# Altium schematic sheet DroneMCU.SchDoc
size A4; SheetNumber: 3; SheetTotal: 3
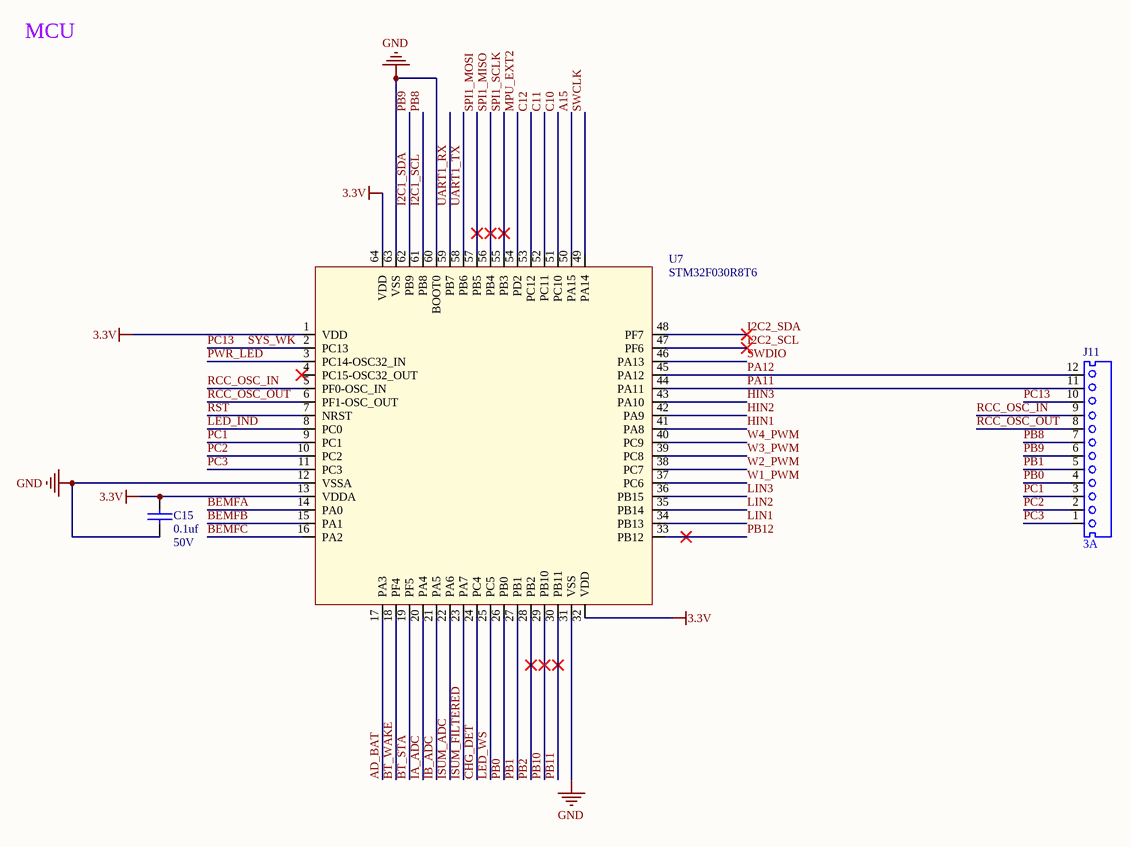
[diagram p0: DroneMCU.SchDoc]

## Parts
C15  value 0.1uf  Voltage: 50V  [CAPC0603-RW]  (hidden comment: PXL456470-1530)
J11  Current: 3A  [CONN 12P PH=2.5 ST HAA250A-12A]  (hidden comment: T690300029300)
U7  MFG Part: STM32F030R8T6  [QFP50P1200X1200X160-64N]  (hidden comment: T610300097225)

## Nets
3.3V: C15.2 U7.1(VDD) U7.13(VDDA) U7.32(VDD) U7.64(VDD)
GND: C15.1 U7.12(VSSA) U7.31(VSS) U7.60(BOOT0) U7.63(VSS)
A15: U7.50(PA15)
AD_BAT: U7.17(PA3)
BEMFA: U7.14(PA0)
BEMFB: U7.15(PA1)
BEMFC: U7.16(PA2)
BT_STA: U7.19(PF5)
BT_WAKE: U7.18(PF4)
C10: U7.51(PC10)
C11: U7.52(PC11)
C12: U7.53(PC12)
CHG_DET: U7.24(PC4)
HIN1: U7.41(PA8)
HIN2: U7.42(PA9)
HIN3: U7.43(PA10)
I2C1_SCL: J11.7 U7.61(PB8)  [also labelled PB8]
I2C1_SDA: J11.6 U7.62(PB9)  [also labelled PB9]
I2C2_SCL: U7.47(PF6)
I2C2_SDA: U7.48(PF7)
IA_ADC: U7.20(PA4)
IB_ADC: U7.21(PA5)
ISUM_ADC: U7.22(PA6)
ISUM_FILTERED: U7.23(PA7)
LED_IND: U7.8(PC0)
LED_WS: U7.25(PC5)
LIN1: U7.34(PB13)
LIN2: U7.35(PB14)
LIN3: U7.36(PB15)
MPU_EXT2: U7.54(PD2)
PA11: J11.11 U7.44(PA11)
PA12: J11.12 U7.45(PA12)
PB0: J11.4 U7.26(PB0)
PB1: J11.5 U7.27(PB1)
PB2: U7.28(PB2)
PB10: U7.29(PB10)
PB11: U7.30(PB11)
PB12: U7.33(PB12)
PC1: J11.3 U7.9(PC1)
PC2: J11.2 U7.10(PC2)
PC3: J11.1 U7.11(PC3)
PC13: J11.10 U7.2(PC13)  [also labelled SYS_WK]
PWR_LED: U7.3(PC14-OSC32_IN)
RCC_OSC_IN: J11.9 U7.5(PF0-OSC_IN)
RCC_OSC_OUT: J11.8 U7.6(PF1-OSC_OUT)
RST: U7.7(NRST)
SPI1_MISO: U7.56(PB4)
SPI1_MOSI: U7.57(PB5)
SPI1_SCLK: U7.55(PB3)
SWCLK: U7.49(PA14)
SWDIO: U7.46(PA13)
UART1_RX: U7.59(PB7)
UART1_TX: U7.58(PB6)
W1_PWM: U7.37(PC6)
W2_PWM: U7.38(PC7)
W3_PWM: U7.39(PC8)
W4_PWM: U7.40(PC9)

Not connected (* = marked no-connect by the designer): U7 4(PC15-OSC32_OUT)*

## Notes on the sheet
- MCU
- Title
- Size:
- Date:
- A4
- Number:
- Time:
- Revision:
- Sheet
- of
- Radio Flyer inc
- West Chicago
- File:

## Library data of the parts
C15 = CAP0603 0.015uF 50V 10%: GP CHIP CAP 0.015uF 50V 10% 0603 TYPE X7R; SAP: T542021537508; Vendor Code: 10010262; Vendor Name: 东莞市晴远电子有限公司; Type: Capacitor; DIP&SMD: SMD; PACKAGE: CAPC0603; MFG: *; MFG Part: *; Other: X7R; Tolerance: 10%; Customer Specific: N/A
J11 = CONN 12P PH=2.5 ST HAA250A-12A: CONNECTOR 12 PIN P:2.5MM P2.54-12 K; Value: 2.5mm; MFG: 金科基; CREATE_NAME: Nathan; DIP&SMD: DIP; SAP: T690300029300; MFG Part: HAA250A-12A; Vendor Name: *; Vendor Code: *; Type: Connector; CREATE_TIME: 10-Aug-2017
U7 = STM32F030RCT6TR: MCU STM32F030RCT6TR LQFP64 ST K; MFG: ST     (STM意法半導體); CREATE_NAME: Nathan; DIP&SMD: SMD; SAP: T610300097225; Type: IC; CREATE_TIME: 02-NOV-2017; Customer Specific: N/A